# Altium schematic sheet Fuente24VDC.SchDoc
size A4; SheetNumber: 2; SheetTotal: 10
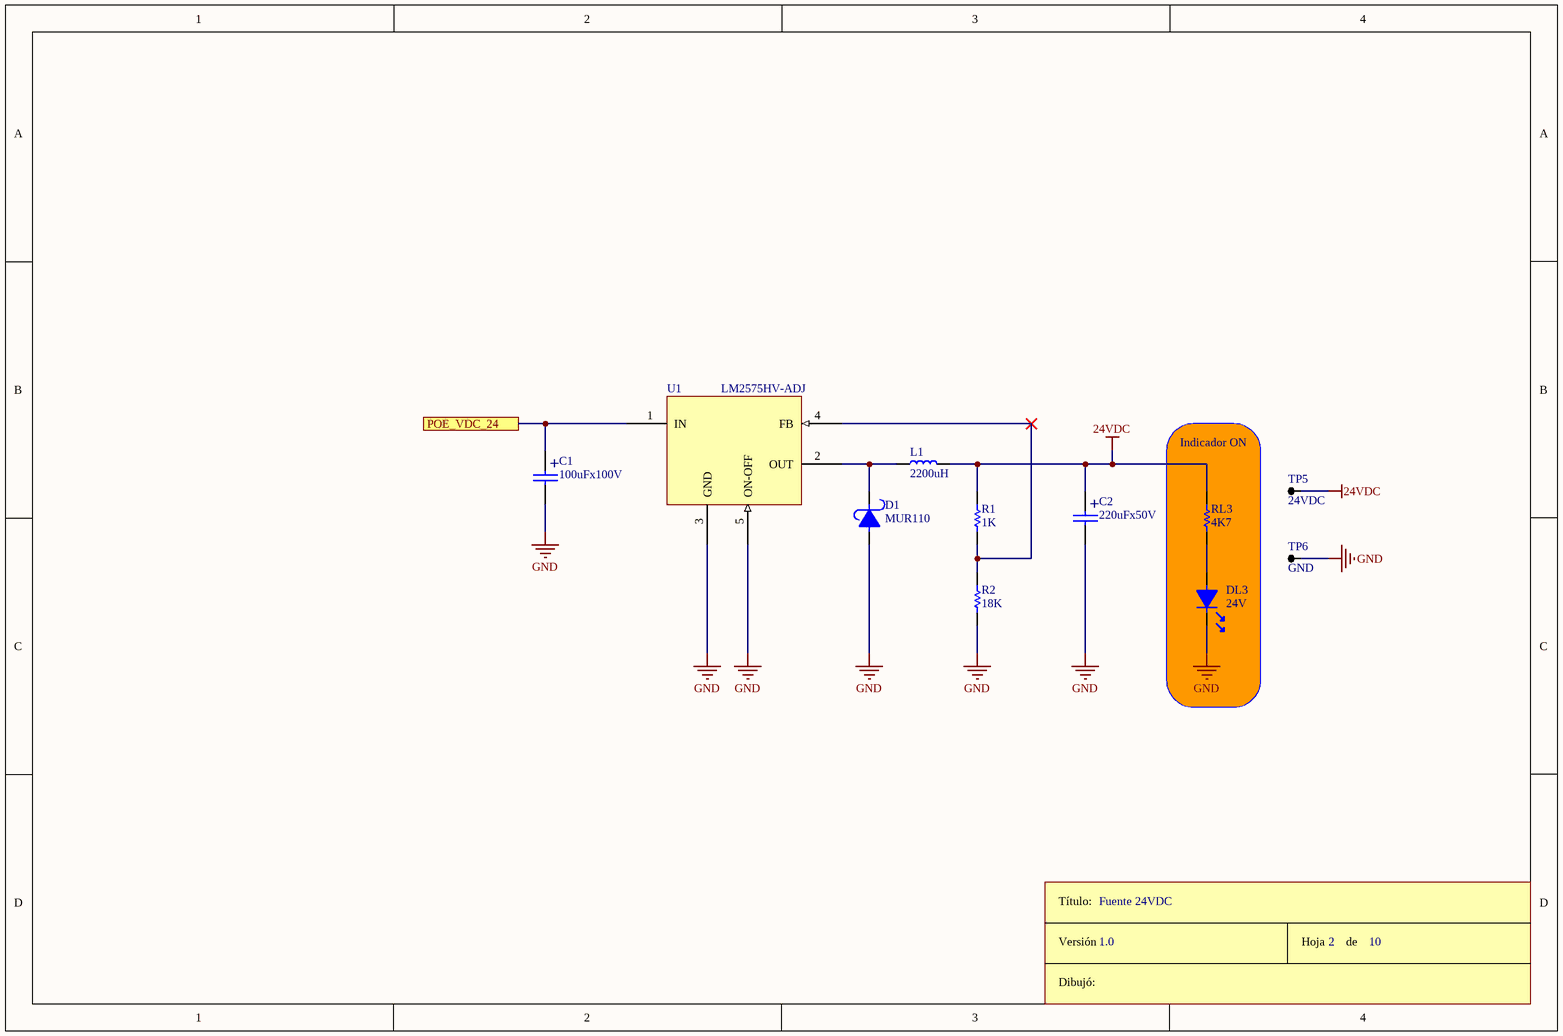
[diagram p0: Fuente24VDC.SchDoc]

## Parts
C1  100uFx100V  [CAP200RP]
C2  220uFx50V  [CAP200RP]
D1  MUR110  [DO41]
DL3  24V  [LED3]
L1  2200uH  [Choke10.5]
R1  1K  [RES300]
R2  18K  [RES300]
RL3  4K7  [RES300]
ROT1  Rótulo  (value not drawn)  (graphical)
TP5  24VDC  [TPTH]
TP6  GND  [TPTH]
U1  LM2575HV-ADJ  [TO220-5]

## Blocks framed on the sheet
Indicador ON: DL3 RL3

## Ports
POE_VDC_24

## Nets
24VDC: C2.1 L1.2 R1.2 RL3.2 TP5.1
GND: C1.2 C2.2 D1.1 DL3.2 R2.1 TP6.1 U1.3(GND) U1.5(ON-OFF)
POE_VDC_24: C1.1 U1.1(IN) ; port POE_VDC_24
NetD1_2: D1.2 L1.1 U1.2(OUT)
NetDL3_1: DL3.1 RL3.1
NetR1_1: R1.1 R2.2 U1.4(FB)

## Notes on the sheet
- Fuente 24VDC
- 1.0
- 2
- 10
- (in symbol CAPPOL) +
- (in symbol Rótulo) Título:; Versión; Hoja       de; Dibujó:

## Library data of the parts
C1 C2 = CAPPOL
D1 = DIODO SCHOTTKY
DL3 = LED
L1 = Choke
R1 R2 RL3 = RES
TP5 TP6 = TP
U1 = LM257X: Buck Switching Regulator IC Positive Output 1A TO-220-5 Formed Leads